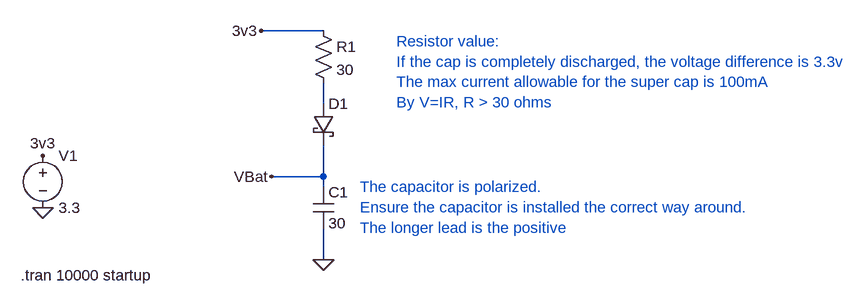
[diagram p0: schematic SuperCapBackup.asc]
SuperCapBackup.asc, the LTspice schematic file:
Version 4
SHEET 1 1016 680
WIRE 144 64 48 64
WIRE 144 176 144 144
WIRE 144 288 144 240
WIRE 144 288 64 288
WIRE 144 304 144 288
WIRE 144 416 144 368
FLAG 48 64 3v3
FLAG 144 416 0
FLAG -288 336 0
FLAG -288 256 3v3
FLAG 64 288 VBat
SYMBOL res 128 48 R0
SYMATTR InstName R1
SYMATTR Value 30
SYMBOL schottky 128 176 R0
SYMATTR InstName D1
SYMATTR Value ""
SYMATTR Description Diode
SYMATTR Type diode
SYMBOL cap 128 304 R0
SYMATTR InstName C1
SYMATTR Value 30
SYMBOL voltage -288 240 R0
SYMATTR InstName V1
SYMATTR Value 3.3
TEXT 256 80 Left 2 ;Resistor value:\nIf the cap is completely discharged, the voltage difference is 3.3v\nThe max current allowable for the super cap is 100mA\nBy V=IR, R > 30 ohms
TEXT -322 440 Left 2 !.tran 10000 startup
TEXT 200 304 Left 2 ;The capacitor is polarized. \nEnsure the capacitor is installed the correct way around. \nThe longer lead is the positive

The netlist it stands for:
* SuperCapBackup.asc
R1 3v3 N001 30
D1 N001 VBat
C1 VBat 0 30
V1 3v3 0 3.3
.model D D
.lib standard.dio
* Resistor value:
* If the cap is completely discharged, the voltage difference is 3.3v
* The max current allowable for the super cap is 100mA
* By V=IR, R > 30 ohms
.tran 10000 startup
* The capacitor is polarized.
* Ensure the capacitor is installed the correct way around.
* The longer lead is the positive
.backanno
.end